# Altium schematic sheet CTR-Lower-Main-Board-Rev-C-Sensors-4.SchDoc: CTR Controller - Sensors
size B; Author: TWL; Organization: OLogic, Inc.; DocumentNumber: 112216; Revision: A; SheetNumber: 4; SheetTotal: 4; PageSetup: Record=PageOptions|CenterHorizontal=True|CenterVertical=True|PrintScale=0.72|XCorrection=1.00|YCorrection=1.00|PrintKind=0|BorderSize=5000000|LeftOffset=0|BottomOffset=0|Orientation=2|PaperLength=1000|PaperWidth=1000|Scale=100|PaperSource=15|PrintQuality=600|MediaType=1|DitherType=10|PrintScaleMode=1|PaperKind=Letter|PaperIndex=1
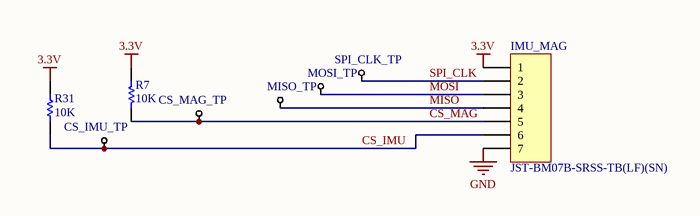
[diagram p0: CTR-Lower-Main-Board-Rev-C-Sensors-4.SchDoc]

## Parts
CS_IMU_TP  Test Point  [TestPoint-TH 42 mil]  (value not drawn)
CS_MAG_TP  Test Point  [TestPoint-TH 42 mil]  (value not drawn)
IMU_MAG  JST-BM07B-SRSS-TB(LF)(SN)  [JST-BM07B-SRSS-TB(LF)(SN)]
MISO_TP  Test Point  [TestPoint-TH 42 mil]  (value not drawn)
MOSI_TP  Test Point  [TestPoint-TH 42 mil]  (value not drawn)
R7  10K  [RESC0402(1005)_N]
R31  10K  [RESC0402(1005)_N]
SPI_CLK_TP  Test Point  [TestPoint-TH 42 mil]  (value not drawn)

## Nets
3.3V: IMU_MAG.1 R7.1 R31.2
GND: IMU_MAG.0 IMU_MAG.7
CS_IMU: CS_IMU_TP.1 IMU_MAG.6 R31.1
CS_MAG: CS_MAG_TP.1 IMU_MAG.5 R7.2
MISO: IMU_MAG.4 MISO_TP.1
MOSI: IMU_MAG.3 MOSI_TP.1
SPI_CLK: IMU_MAG.2 SPI_CLK_TP.1

## Notes on the sheet
- Title
- By:
- Date:
- Number:
- Time:
- Revision:
- Sheet
- of
- OLogic, Inc.
- 1394 Borregas Ave.
- Sunnyvale, CA
- 94089 USA
- File:
- (650) 996-1490

## Library data of the parts
CS_IMU_TP CS_MAG_TP MISO_TP MOSI_TP SPI_CLK_TP = TestPoint, small: ClassName: IMU
IMU_MAG = JST-BM07B-SRSS-TB(LF)(SN): 1mm Locking Header, 7-Pin; Manufacturer: JST Sales America Inc.; Pitch - Mating: 0.039" (1.00mm); Shrouding: Shrouded - 4 Wall; Number of Positions: 7; Number of Positions Loaded: All; Supplier 1: Digi-Key; Manufacturer Part Number: BM07B-SRSS-TB(LF)(SN); RoHS: RoHS Compliant; Category: Connectors, Interconnects; Stock 1: 16709; Pricing 1: 1=0.84, 10=0.734, 100=0.6335, 500=0.51832 (USD); Packaging: Cut Tape (CT); Part Status: Active; Connector Type: Header; Contact Type: Male Pin; Number of Rows: 1; Row Spacing - Mating: -; Mounting Type: Surface Mount; Termination: Solder; Fastening Type: -; Contact Length - Mating: -; Features: Solder Retention; Contact Finish - Mating: Tin; Contact Finish Thickness - Mating: -; Insulation Color: Natural; Ingress Protection: -; ComponentLink1URL: http://www.jst-mfg.com/product/pdf/eng/eSH.pdf; ComponentLink1Description: http://www.jst-mfg.com/product/pdf/eng/eSH.pdf; Supplier Part Number 1: 455-1793-1-ND
R7 R31 = RES 10K OHM 5% 1/10W 0402: 10K 0402; Manufacturer: Panasonic Electronic Components; Manufacturer Part Number: ERJ-2GEJ103X; Tolerance: ±5%; Power (Watts): 0.1W, 1/10W; Temperature Coefficient: ±200ppm/°C; ClassName: IMU; Creator: ted; Supplier 1: Digi-Key; RoHS: RoHS Compliant; Category: Resistors; Stock 1: 5772999; Pricing 1: 1=0.1, 50=0.0106, 100=0.0078, 250=0.00596, 500=0.00476, 1000=0.0035, 5000=0.00251 (USD); Packaging: Cut Tape (CT); Resistance (Ohms): 10k; Composition: Thick Film; Features: Automotive AEC-Q200; Operating Temperature: -55°C ~ 155°C; Package / Case: 0402 (1005 Metric); Supplier Device Package: 0402; Size / Dimension: 0.039" L x 0.020" W (1.00mm x 0.50mm); Height: 0.016" (0.40mm); Number of Terminations: 2; ComponentLink1URL: http://industrial.panasonic.com/www-cgi/jvcr13pz.cgi?E+PZ+3+AOA0001+ERJ2GEJ103X+7+WW; ComponentLink1Description: http://industrial.panasonic.com/www-cgi/jvcr13pz.cgi?E+PZ+3+AOA0001+ERJ2GEJ103X+7+WW; Supplier Part Number 1: P10KJCT-ND